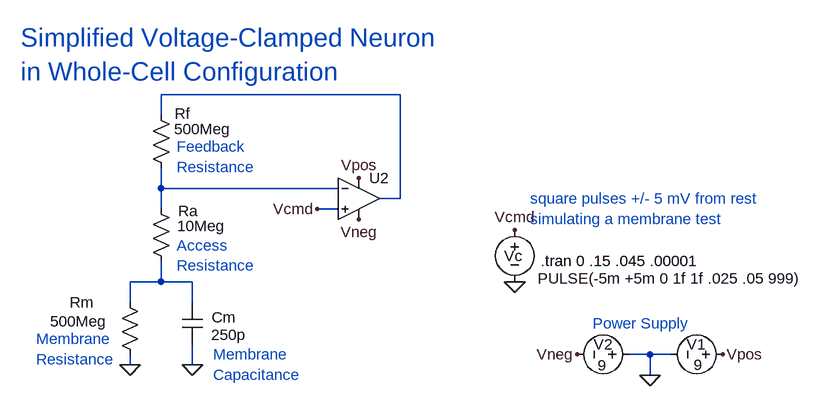
[diagram p0: schematic voltage-clamp-simple.asc]
voltage-clamp-simple.asc, the LTspice schematic file:
Version 4
SHEET 1 1412 800
WIRE 512 48 144 48
WIRE 144 80 144 48
WIRE 144 192 144 160
WIRE 416 192 144 192
WIRE 512 208 512 48
WIRE 512 208 480 208
WIRE 144 224 144 192
WIRE 416 224 384 224
WIRE 144 336 144 304
WIRE 144 336 96 336
WIRE 192 336 144 336
WIRE 96 368 96 336
WIRE 192 368 192 336
WIRE 896 448 864 448
WIRE 928 448 896 448
WIRE 96 464 96 448
WIRE 192 464 192 432
WIRE 896 480 896 448
FLAG 1008 448 Vpos
FLAG 448 176 Vpos
FLAG 448 240 Vneg
FLAG 784 448 Vneg
FLAG 688 336 0
FLAG 192 464 0
FLAG 896 480 0
FLAG 384 224 Vcmd
FLAG 688 256 Vcmd
FLAG 96 464 0
SYMBOL res 128 64 R0
WINDOW 0 37 13 Left 2
WINDOW 3 36 37 Left 2
SYMATTR InstName Rf
SYMATTR Value 500Meg
SYMBOL voltage 1024 448 R90
WINDOW 0 -16 42 VRight 2
WINDOW 3 16 47 VRight 2
WINDOW 123 0 0 Left 0
WINDOW 39 0 0 Left 0
SYMATTR InstName V1
SYMATTR Value 9
SYMBOL OpAmps\\UniversalOpamp2 448 208 R0
SYMATTR InstName U2
SYMATTR Value2 ""
SYMATTR SpiceLine ""
SYMATTR SpiceLine2 ""
SYMBOL voltage 880 448 R90
WINDOW 0 -16 41 VRight 2
WINDOW 3 17 51 VRight 2
WINDOW 123 0 0 Left 0
WINDOW 39 0 0 Left 0
SYMATTR InstName V2
SYMATTR Value 9
SYMBOL voltage 688 240 R0
WINDOW 123 0 0 Left 0
WINDOW 39 0 0 Left 0
WINDOW 0 -16 56 Left 2
WINDOW 3 35 91 Left 2
SYMATTR InstName Vc
SYMATTR Value PULSE(-5m +5m 0 1f 1f .025 .05 999)
SYMBOL res 128 208 R0
WINDOW 0 42 19 Left 2
WINDOW 3 41 42 Left 2
SYMATTR InstName Ra
SYMATTR Value 10Meg
SYMBOL cap 176 368 R0
WINDOW 0 46 23 Left 2
WINDOW 3 45 50 Left 2
SYMATTR InstName Cm
SYMATTR Value 250p
SYMATTR SpiceLine Rser=0 Lser=0 Rpar=0 Cpar=0
SYMBOL res 80 352 R0
WINDOW 0 -77 16 Left 2
WINDOW 3 -107 45 Left 2
SYMATTR InstName Rm
SYMATTR Value 500Meg
TEXT 712 208 Left 2 ;square pulses +/- 5 mV from rest\nsimulating a membrane test
TEXT 168 280 Left 2 ;Access\nResistance
TEXT -48 424 Left 2 ;Membrane\nResistance
TEXT 224 448 Left 2 ;Membrane\nCapacitance
TEXT 808 400 Left 2 ;Power Supply
TEXT -72 -40 Left 4 ;Simplified Voltage-Clamped Neuron\nin Whole-Cell Configuration
TEXT 728 304 Left 2 !.tran 0 .15 .045 .00001
TEXT 168 128 Left 2 ;Feedback\nResistance

The netlist it stands for:
* voltage-clamp-simple.asc
Rf N001 N002 500Meg
V1 Vpos 0 9
XU2 Vcmd N002 Vpos Vneg N001 level.2  ; pins IN+ IN- V+ V- OUT
V2 0 Vneg 9
Vc Vcmd 0 PULSE(-5m +5m 0 1f 1f .025 .05 999)
Ra N002 N003 10Meg
Cm N003 0 250p Rser=0 Lser=0 Rpar=0 Cpar=0
Rm N003 0 500Meg
* square pulses +/- 5 mV from rest
* simulating a membrane test
* Access
* Resistance
* Membrane
* Resistance
* Membrane
* Capacitance
* Power Supply
* Simplified Voltage-Clamped Neuron
* in Whole-Cell Configuration
.tran 0 .15 .045 .00001
* Feedback
* Resistance
.lib UniversalOpamps2.sub
.backanno
.end